# Altium project 15. LED Bar Graph Voltage Display.PrjPcb
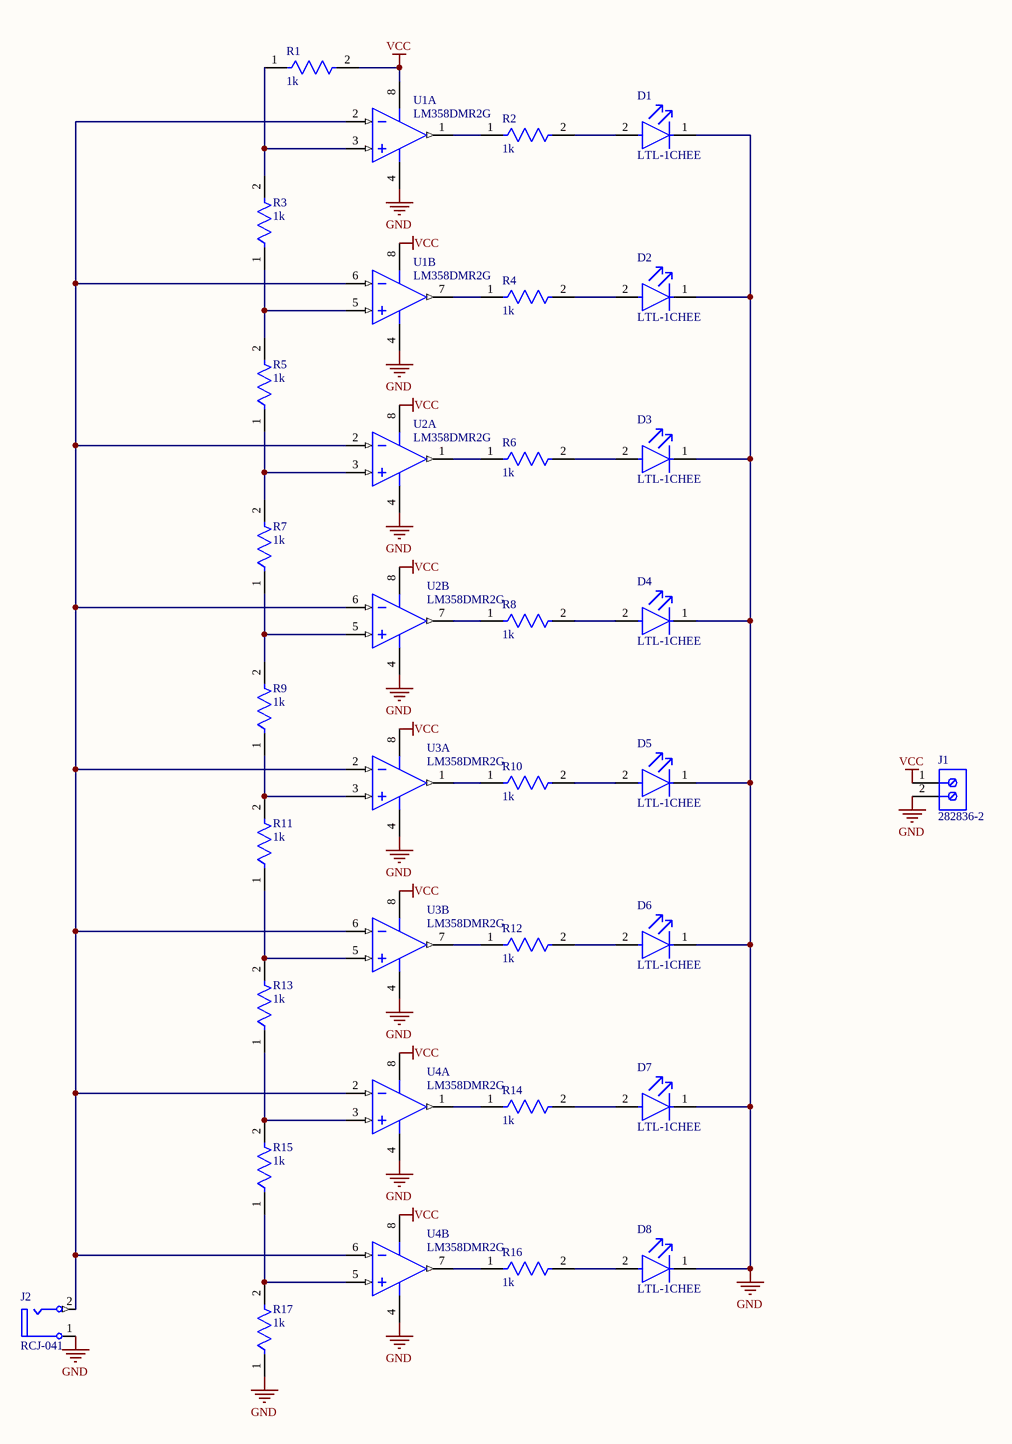
[diagram p0: LED Bar Graph Voltage Display.SchDoc]
1 sheet, 31 parts. Net scope: global (net labels, ports and power ports of the same name join across sheets).
Board file: LED Bar Graph Voltage Display.PcbDoc

## Sheet LED Bar Graph Voltage Display.SchDoc
size A2 portrait; SheetNumber: 1; SheetTotal: 1

### Parts
D1  LTL-1CHEE  [FP-LTL-1CHEE-MFG]
D2  LTL-1CHEE  [FP-LTL-1CHEE-MFG]
D3  LTL-1CHEE  [FP-LTL-1CHEE-MFG]
D4  LTL-1CHEE  [FP-LTL-1CHEE-MFG]
D5  LTL-1CHEE  [FP-LTL-1CHEE-MFG]
D6  LTL-1CHEE  [FP-LTL-1CHEE-MFG]
D7  LTL-1CHEE  [FP-LTL-1CHEE-MFG]
D8  LTL-1CHEE  [FP-LTL-1CHEE-MFG]
J1  282836-2  [TECO-282836-2_V]
J2  RCJ-041  [CUI-RCJ-041_V]
R1  1k  [FP-CF14-MFG]
R2  1k  [FP-CF14-MFG]
R3  1k  [FP-CF14-MFG]
R4  1k  [FP-CF14-MFG]
R5  1k  [FP-CF14-MFG]
R6  1k  [FP-CF14-MFG]
R7  1k  [FP-CF14-MFG]
R8  1k  [FP-CF14-MFG]
R9  1k  [FP-CF14-MFG]
R10  1k  [FP-CF14-MFG]
R11  1k  [FP-CF14-MFG]
R12  1k  [FP-CF14-MFG]
R13  1k  [FP-CF14-MFG]
R14  1k  [FP-CF14-MFG]
R15  1k  [FP-CF14-MFG]
R16  1k  [FP-CF14-MFG]
R17  1k  [FP-CF14-MFG]
U1  LM358DMR2G  [ONSC-MICRO-8-846A-02_H_V]  (parts A,B of 2)
U2  LM358DMR2G  [ONSC-MICRO-8-846A-02_H_V]  (parts A,B of 2)
U3  LM358DMR2G  [ONSC-MICRO-8-846A-02_H_V]  (parts A,B of 2)
U4  LM358DMR2G  [ONSC-MICRO-8-846A-02_H_V]  (parts A,B of 2)

### Nets
GND: D1.1(C) D2.1(C) D3.1(C) D4.1(C) D5.1(C) D6.1(C) D7.1(C) D8.1(C) J1.2 J2.1 R17.1 U1.4(VEE/GND) U2.4(VEE/GND) U3.4(VEE/GND) U4.4(VEE/GND)
VCC: J1.1 R1.2 U1.8(VCC) U2.8(VCC) U3.8(VCC) U4.8(VCC)
NetD1_2: D1.2(A) R2.2
NetD2_2: D2.2(A) R4.2
NetD3_2: D3.2(A) R6.2
NetD4_2: D4.2(A) R8.2
NetD5_2: D5.2(A) R10.2
NetD6_2: D6.2(A) R12.2
NetD7_2: D7.2(A) R14.2
NetD8_2: D8.2(A) R16.2
NetJ2_2: J2.2 U1.2(INA-) U1.6(INB-) U2.2(INA-) U2.6(INB-) U3.2(INA-) U3.6(INB-) U4.2(INA-) U4.6(INB-)
NetR1_1: R1.1 R3.2 U1.3(INA+)
NetR2_1: R2.1 U1.1(OUTA)
NetR3_1: R3.1 R5.2 U1.5(INB+)
NetR4_1: R4.1 U1.7(OUTB)
NetR5_1: R5.1 R7.2 U2.3(INA+)
NetR6_1: R6.1 U2.1(OUTA)
NetR7_1: R7.1 R9.2 U2.5(INB+)
NetR8_1: R8.1 U2.7(OUTB)
NetR9_1: R9.1 R11.2 U3.3(INA+)
NetR10_1: R10.1 U3.1(OUTA)
NetR11_1: R11.1 R13.2 U3.5(INB+)
NetR12_1: R12.1 U3.7(OUTB)
NetR13_1: R13.1 R15.2 U4.3(INA+)
NetR14_1: R14.1 U4.1(OUTA)
NetR15_1: R15.1 R17.2 U4.5(INB+)
NetR16_1: R16.1 U4.7(OUTB)

### Library data of the parts
D1-D8 = CMP-22017-000040-1: LED RED CLEAR T/H; Viewing Angle: 45°; Power Dissipation: 100mW; Wavelength: 635nm; Number of LEDs: 1; Test Current: 10mA; Lens Style: Dome; Forward Current: 30mA; Forward Voltage: 2V; Luminous Intensity: 19mcd; Reverse Voltage: 5V; Dominant Wavelength: 625nm; RoHS Compliant: Yes; Mount: Through Hole; Diameter: 3.1mm; Package Quantity: 1000; Lens Transparency: Clear; Illumination Color: Red; Lens Color: Red; Max Operating Temperature: 100°C; Radiation Hardening: No; Case/Package: T; Width: 3.8mm; Length: 3.8mm; Depth: 3.8mm; Series: -; Number of Pins: 2; Number of Elements: 1; Height: 5.2mm; Max Power Dissipation: 100mW; Lead Free: Lead Free; Packaging: Bulk; Color: Red; Min Operating Temperature: -55°C
J1 = CMP-1684-00017-1: Female Header, Pitch 5 mm, 1 x 2 Position, Height 10 mm, Tail Length 3.5 mm, Rohs, Bulk; Manufacturer: TE Connectivity; Wire Gauge: 16-30AWG; Product Training Modules: Wire-to-BoardEurostyleTerminalBlocks; Clamp Material - Plating: Brass-NickelPlated; Voltage: 300V; Mating Orientation: HorizontalwithBoard; Current: 13.5A; Pitch: 0.197"(5.00mm); Screw Thread: M3; 3D Model: 282836-2.pdf; Other Names: 5ULV-02B / A98076; Dynamic Catalog: BuchananSeries; Number of Levels: 1; Torque - Screw: 0.68Nm(6Lb-In); Featured Product: EurostyleTerminalBlockConnectors; Positions Per Level: 2; Wire Termination: Screw-RisingCageClamp; Datasheet URL: http://www.te.com.cn/commerce/DocumentDelivery/DDEController?Action=showdoc&DocId=Catalog+Section%7F1308389_EUROSTYLE_TERMINAL_BLOCKS%7F0607%7Fpdf%7FEnglish%7FENG_CS_1308389_EUROSTYLE_TERMINAL_BLOCKS_0607.pdf%7F282836-2; Color: Green; Family: TerminalBlocks-WiretoBoard; RoHS Information: 282836-2StatementofCompliance; Standard Package: 300; Contact Material - Plating: Brass-TinPlated; Manufacturer URL: http://www.te.com; Housing Material: Polyamide(PA66),Nylon6/6; Features: Interlocking(Side); Package Description: Female Header, Pitch 5 mm, 1 x 2 Position, Height 10 mm, Tail Length 3.5 mm; Mounting Type: ThroughHole; Package Reference: THD; Packaging: Bulk; Series: Buchanan; Category: Connectors,Interconnects; Screw Material - Plating: Brass-NickelPlated
J2 = CMP-1692-00002-1: Female RCJ Jack, 2 Position, Height 11.724 mm, Tail Length 4 mm, RoHS, Bulk; Case\Package: Metal; Connector Type: HDMI; Current Rating: 500 mA; Voltage Rating: 40 V; Length: 16.2 mm; Pins: 19; ComponentLink1URL: http://www.cui.com/; ComponentLink1Description: Manufacturer URL; Packaging: Tape and Reel; Lead Pitch: 0.5 mm; PackageDescription: Female RCJ Jack, 2 Position, Height 11.724 mm, Tail Length 4 mm; RoHSCompliant: true; Min Operating Temperature: -55 degC; Height: 6.1 mm; Contact Material: Copper; REACH SVHC: No SVHC; DatasheetVersion: Rev. B, 02/2012; ComponentLink2Description: Datasheet; Contact Plating: Gold; Colour: Black; Max Operating Temperature: 85 degC; Mount: Surface Mount; Package Quantity: 400; Gender: Female; ComponentLink2URL: http://www.cui.com/product/resource/rcj-04x.pdf; PackageReference: RCJ-041
R1-R17 = CMP-26528-000003-1: RES 7.5K OHM 1/4W 5% AXIAL; Max Power Dissipation: 250mW; Temperature Coefficient: -400ppm/°C; Resistance: 7.5kR; RoHS Compliant: Yes; Lead Free: Lead Free; Max Operating Temperature: 155°C; Case/Package: Axial; Tolerance: 5%; Power Rating: 250mW; Diameter: 2.3mm; Features: Flame Retardant Coating; Series: CF; Resistor Type: Carbon Film; Number of Terminations: 2; Length: 0.256inch; Min Operating Temperature: -55°C; Contact Plating: Tin; Packaging: Tape and Reel; Mount: Through Hole; Radiation Hardening: No
U1-U4 = CMP-1310-00018-1: Single Supply Dual Operational Amplifier, 3 to 32 V, 0 to 70 degC, 8-Pin MICRO, Pb-Free, Tape and Reel; Manufacturer: On Semiconductor; VCC Min (V): 3; VCC Max (V): 32; PackageDescription: 8-Pin Small Outline Package, Body 3 x 3 mm, Pitch 0.65 mm; ComponentLink2URL: http://www.onsemi.cn/pub_link/Collateral/LM358-D.PDF; ComponentLink2Description: Datasheet; ComponentLink1Description: Manufacturer URL; PackageVersion: Rev. H; Packing: Tape and Reel; RoHS: TRUE; DatasheetVersion: Rev. 27; PartNumber: LM358DMR2G; ComponentLink3Description: Package Specification; ComponentLink1URL: http://www.onsemi.com/; Mounting Technology: Surface Mount; ComponentLink3URL: http://www.onsemi.com/pub_link/Collateral/NLSV2T244-D.PDF; PackageReference: MICRO-8-846A-02_H